# EAGLE schematic mosfet board_v2 (EAGLE 8.2.0)

## Sheet 1 of 2
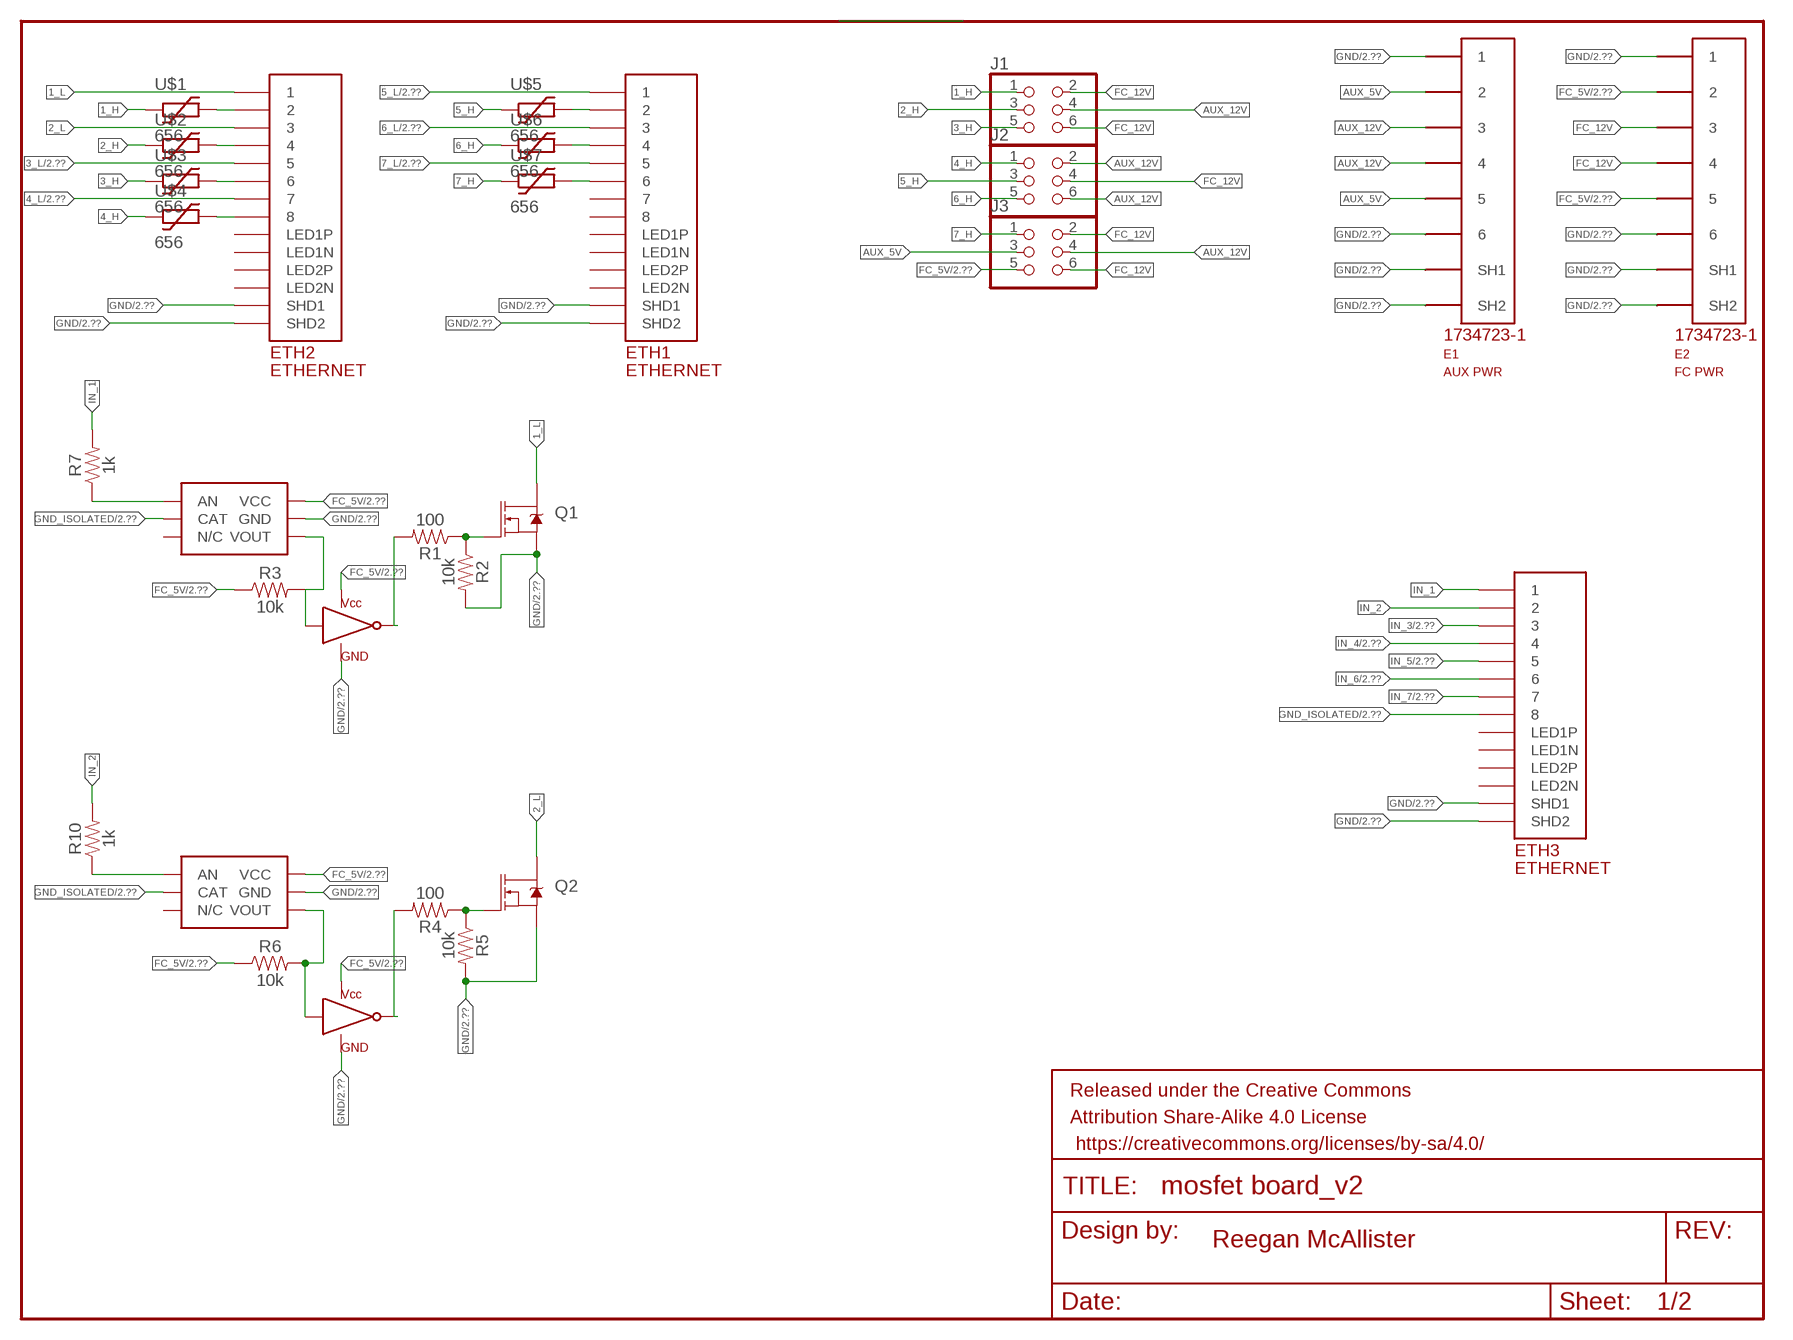
[diagram p0: schematic, sheet 1]

### Parts
E1  AUX PWR  5555140-6  [1734723-1_RJ11]
E2  FC PWR  5555140-6  [1734723-1_RJ11]
ETH1  ETHERNET  [A122645-ND]
ETH2  ETHERNET  [A122645-ND]
ETH3  ETHERNET  [A122645-ND]
FRAME1  FRAME-LETTERNO_PACKAGE  [DUMMY]
J1  PINHD-2X3  [2X03]
J2  PINHD-2X3  [2X03]
J3  PINHD-2X3  [2X03]
Q1  MOSFET-NCH-AO3404A  [SOT23-3]
Q2  MOSFET-NCH-AO3404A  [SOT23-3]
R1  100  RESISTOR0805  [0805]
R2  10k  RESISTOR0805  [0805]
R3  10k  RESISTOR0805  [0805]
R4  100  RESISTOR0805  [0805]
R5  10k  RESISTOR0805  [0805]
R6  10k  RESISTOR0805  [0805]
R7  1k  RESISTOR0805  [0805]
R10  1k  RESISTOR0805  [0805]
U$1  656  [656]
U$2  656  [656]
U$3  656  [656]
U$4  656  [656]
U$5  656  [656]
U$6  656  [656]
U$7  656  [656]
U$8  H11L1M  [H11L1M]
U$9  SN74LVC1G04-Q1  [SOT-23-5]
U$10  H11L1M  [H11L1M]
U$11  SN74LVC1G04-Q1  [SOT-23-5]

### Nets
1_H: J1.1 U$1.P$1
1_L: ETH2.P$1 Q1.3(D)
2_H: J1.3 U$2.P$1
2_L: ETH2.P$3 Q2.3(D)
3_H: J1.5 U$3.P$1
3_L: ETH2.P$5 ; also sheet 2
4_H: J2.1 U$4.P$1
4_L: ETH2.P$7 ; also sheet 2
5_H: J2.3 U$5.P$1
5_L: ETH1.P$1 ; also sheet 2
6_H: J2.5 U$6.P$1
6_L: ETH1.P$3 ; also sheet 2
7_H: J3.1 U$7.P$1
7_L: ETH1.P$5 ; also sheet 2
AUX_5V: E1.2 E1.5 J3.3
AUX_12V: E1.3 E1.4 J1.4 J2.2 J2.6 J3.4
FC_5V: E2.2 E2.5 J3.5 R3.1 R6.1 U$8.P$6(VCC) U$9.P$5(VCC) U$10.P$6(VCC) U$11.P$5(VCC) ; also sheet 2
FC_12V: E2.3 E2.4 J1.2 J1.6 J2.4 J3.2 J3.6
GND: E1.1 E1.6 E1.SH1 E1.SH2 E2.1 E2.6 E2.SH1 E2.SH2 ETH1.P$13(SHD1) ETH1.P$14(SHD2) ETH2.P$13(SHD1) ETH2.P$14(SHD2) ETH3.P$13(SHD1) ETH3.P$14(SHD2) Q1.2(S) Q2.2(S) R2.2 R5.2 U$8.P$5(GND) U$9.P$1(GND) U$9.P$3(GND) U$10.P$5(GND) U$11.P$1(GND) U$11.P$3(GND) ; also sheet 2
GND_ISOLATED: ETH3.P$8 U$8.P$2(CAT) U$10.P$2(CAT) ; also sheet 2
IN_1: ETH3.P$1 R7.2
IN_2: ETH3.P$2 R10.2
IN_3: ETH3.P$3 ; also sheet 2
IN_4: ETH3.P$4 ; also sheet 2
IN_5: ETH3.P$5 ; also sheet 2
IN_6: ETH3.P$6 ; also sheet 2
IN_7: ETH3.P$7 ; also sheet 2
N$1: ETH2.P$2 U$1.P$2
N$3: ETH2.P$4 U$2.P$2
N$4: ETH2.P$6 U$3.P$2
N$5: ETH2.P$8 U$4.P$2
N$6: ETH1.P$2 U$5.P$2
N$7: Q1.1(G) R1.1 R2.1
N$8: R3.2 U$8.P$4(VOUT) U$9.P$2(IN)
N$9: R1.2 U$9.P$4(OUT)
N$10: ETH1.P$6 U$7.P$2
N$11: ETH1.P$4 U$6.P$2
N$12: Q2.1(G) R4.1 R5.1
N$17: R6.2 U$10.P$4(VOUT) U$11.P$2(IN)
N$18: R4.2 U$11.P$4(OUT)
N$25: R10.1 U$10.P$1(AN)
N$26: R7.1 U$8.P$1(AN)
Unconnected: ETH1.P$7 ETH1.P$8 ETH1.P$9(LED1N) ETH1.P$10(LED1P) ETH1.P$11(LED2N) ETH1.P$12(LED2P) ETH2.P$9(LED1N) ETH2.P$10(LED1P) ETH2.P$11(LED2N) ETH2.P$12(LED2P) ETH3.P$9(LED1N) ETH3.P$10(LED1P) ETH3.P$11(LED2N) ETH3.P$12(LED2P) U$8.P$3(N/C) U$10.P$3(N/C)

### Notes on the sheet
- Reegan McAllister

## Sheet 2 of 2
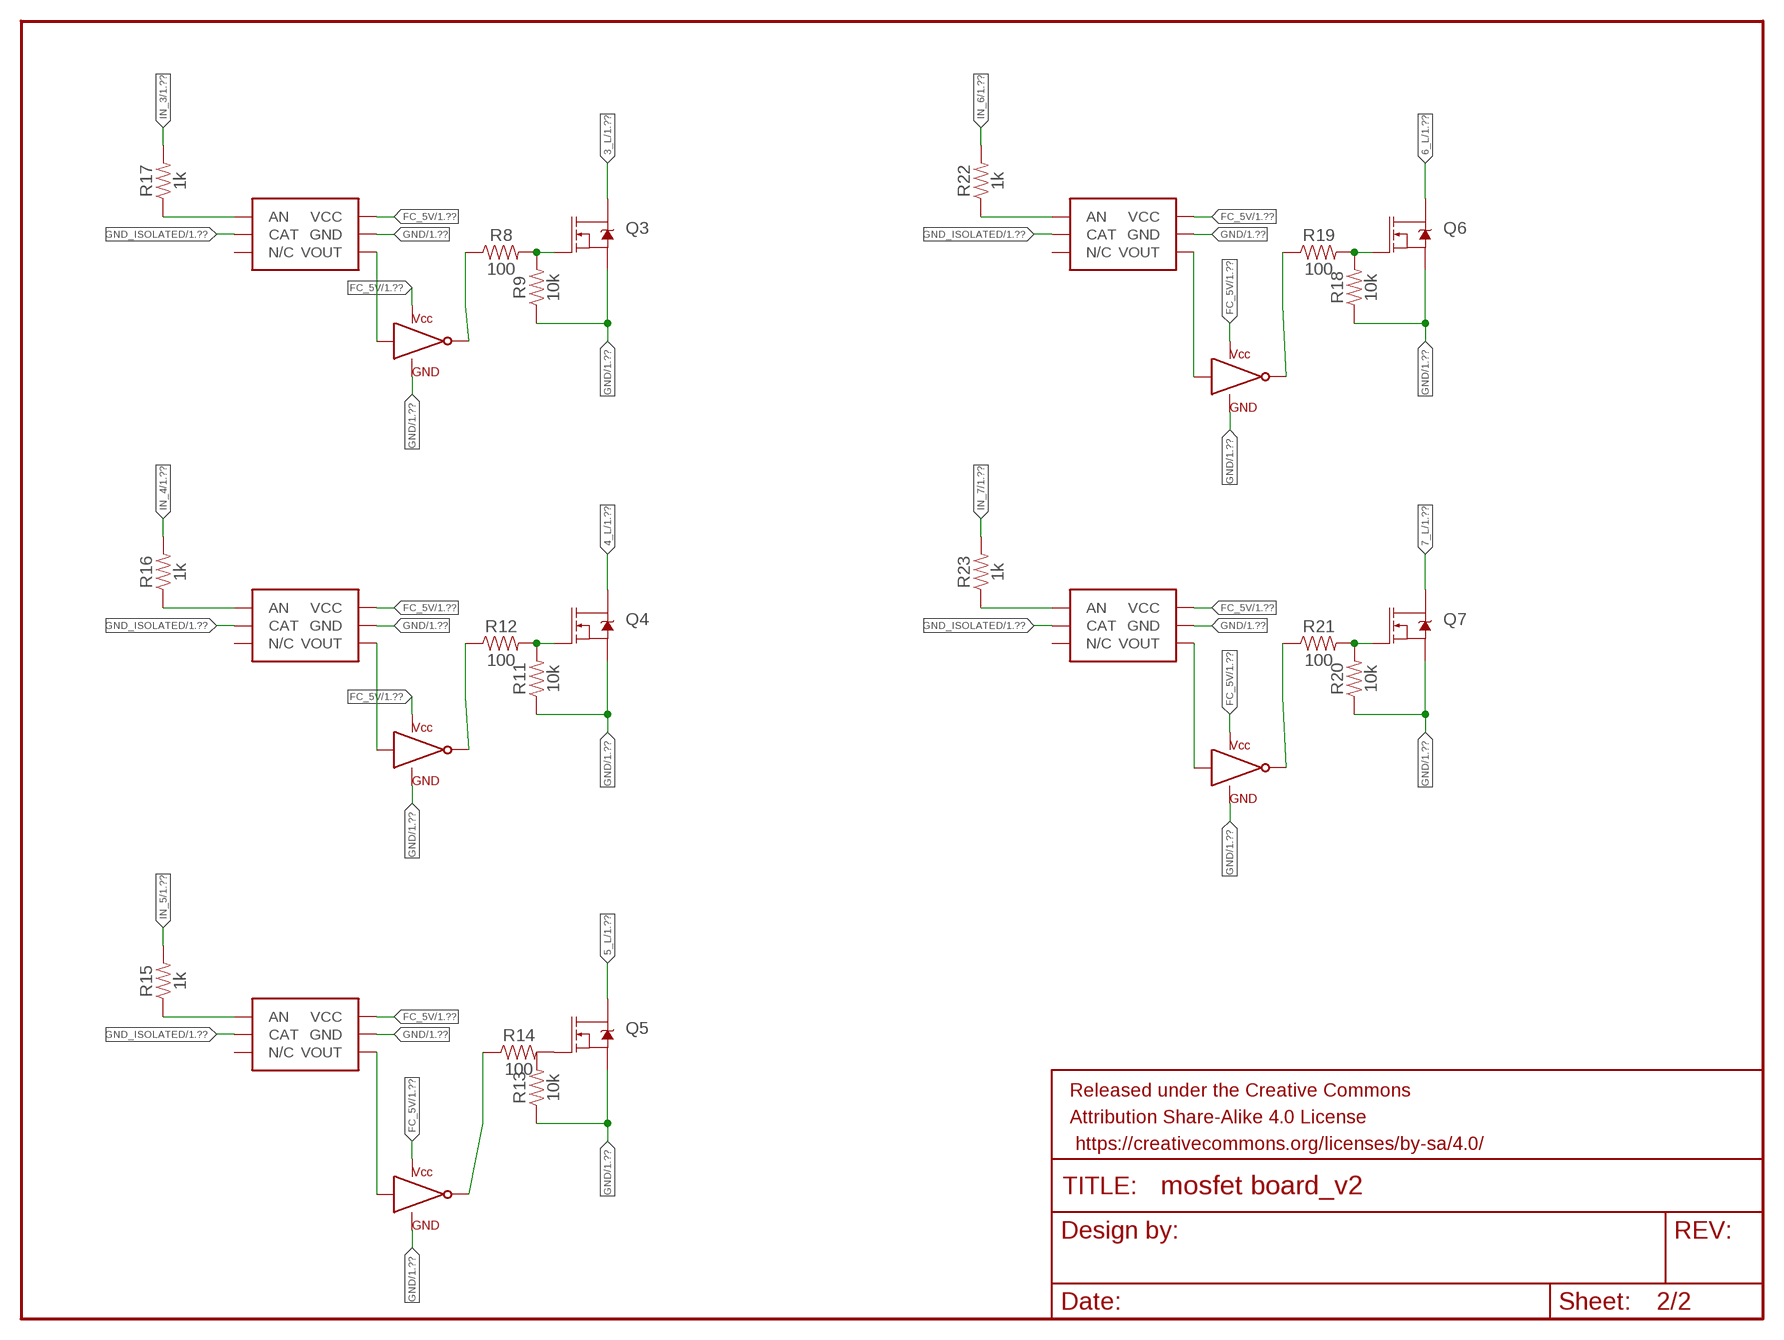
[diagram p1: schematic, sheet 2]

### Parts
FRAME2  FRAME-LETTERNO_PACKAGE  [DUMMY]
Q3  MOSFET-NCH-AO3404A  [SOT23-3]
Q4  MOSFET-NCH-AO3404A  [SOT23-3]
Q5  MOSFET-NCH-AO3404A  [SOT23-3]
Q6  MOSFET-NCH-AO3404A  [SOT23-3]
Q7  MOSFET-NCH-AO3404A  [SOT23-3]
R8  100  RESISTOR0805  [0805]
R9  10k  RESISTOR0805  [0805]
R11  10k  RESISTOR0805  [0805]
R12  100  RESISTOR0805  [0805]
R13  10k  RESISTOR0805  [0805]
R14  100  RESISTOR0805  [0805]
R15  1k  RESISTOR0805  [0805]
R16  1k  RESISTOR0805  [0805]
R17  1k  RESISTOR0805  [0805]
R18  10k  RESISTOR0805  [0805]
R19  100  RESISTOR0805  [0805]
R20  10k  RESISTOR0805  [0805]
R21  100  RESISTOR0805  [0805]
R22  1k  RESISTOR0805  [0805]
R23  1k  RESISTOR0805  [0805]
U$12  H11L1M  [H11L1M]
U$13  SN74LVC1G04-Q1  [SOT-23-5]
U$14  H11L1M  [H11L1M]
U$15  SN74LVC1G04-Q1  [SOT-23-5]
U$16  H11L1M  [H11L1M]
U$17  SN74LVC1G04-Q1  [SOT-23-5]
U$18  H11L1M  [H11L1M]
U$19  SN74LVC1G04-Q1  [SOT-23-5]
U$20  H11L1M  [H11L1M]
U$21  SN74LVC1G04-Q1  [SOT-23-5]

### Nets
3_L: Q3.3(D) ; also sheet 1
4_L: Q4.3(D) ; also sheet 1
5_L: Q5.3(D) ; also sheet 1
6_L: Q6.3(D) ; also sheet 1
7_L: Q7.3(D) ; also sheet 1
FC_5V: U$12.P$6(VCC) U$13.P$5(VCC) U$14.P$6(VCC) U$15.P$5(VCC) U$16.P$6(VCC) U$17.P$5(VCC) U$18.P$6(VCC) U$19.P$5(VCC) U$20.P$6(VCC) U$21.P$5(VCC) ; also sheet 1
GND: Q3.2(S) Q4.2(S) Q5.2(S) Q6.2(S) Q7.2(S) R9.1 R11.1 R13.1 R18.1 R20.1 U$12.P$5(GND) U$13.P$1(GND) U$13.P$3(GND) U$14.P$5(GND) U$15.P$1(GND) U$15.P$3(GND) U$16.P$5(GND) U$17.P$1(GND) U$17.P$3(GND) U$18.P$5(GND) U$19.P$1(GND) U$19.P$3(GND) U$20.P$5(GND) U$21.P$1(GND) U$21.P$3(GND) ; also sheet 1
GND_ISOLATED: U$12.P$2(CAT) U$14.P$2(CAT) U$16.P$2(CAT) U$18.P$2(CAT) U$20.P$2(CAT) ; also sheet 1
IN_3: R17.2 ; also sheet 1
IN_4: R16.2 ; also sheet 1
IN_5: R15.2 ; also sheet 1
IN_6: R22.2 ; also sheet 1
IN_7: R23.2 ; also sheet 1
N$13: Q3.1(G) R8.2 R9.2
N$14: Q4.1(G) R11.2 R12.2
N$15: Q5.1(G) R14.2
N$16: Q6.1(G) R18.2 R19.2
N$19: Q7.1(G) R20.2 R21.2
N$20: R17.1 U$12.P$1(AN)
N$21: R16.1 U$14.P$1(AN)
N$22: R15.1 U$16.P$1(AN)
N$23: R22.1 U$18.P$1(AN)
N$24: R23.1 U$20.P$1(AN)
N$29: U$12.P$4(VOUT) U$13.P$2(IN)
N$30: R8.1 U$13.P$4(OUT)
N$38: U$16.P$4(VOUT) U$17.P$2(IN)
N$41: R14.1 U$17.P$4(OUT)
N$46: U$14.P$4(VOUT) U$15.P$2(IN)
N$47: R12.1 U$15.P$4(OUT)
N$54: U$20.P$4(VOUT) U$21.P$2(IN)
N$59: R21.1 U$21.P$4(OUT)
N$64: U$18.P$4(VOUT) U$19.P$2(IN)
N$67: R19.1 U$19.P$4(OUT)
Unconnected: R13.2 U$12.P$3(N/C) U$14.P$3(N/C) U$16.P$3(N/C) U$18.P$3(N/C) U$20.P$3(N/C)

## Library data of the parts
E1 E2 = 5555140-6 RJ11:5555140-6
ETH1-ETH3 = ETHERNET:ETHERNET: Ethernet port with 2 leds. digikey number A122645-ND
FRAME1 FRAME2 = FRAME-LETTER:FRAME-LETTER: Schematic Frame Standard 8.5x11 US Letter frame; DESIGNER: Nobody; VERSION: v01
J1-J3 = SparkFun-Connectors:PINHD-2X3: PIN HEADER
Q1-Q7 = n-mos switch:MOSFET-NCH
R1-R23 = Resistor:RESISTOR: Generic Resistor Package
U$1-U$7 = GlassFuseHolder:656
U$8 U$10 U$12 U$14 U$16 U$18 U$20 = H11L1M:H11L1M: open collector opto-isolator
U$9 U$11 U$13 U$15 U$17 U$19 U$21 = SN74LVC1G04-Q1:SN74LVC1G04-Q1: inverter logic gate